# Altium project Example.PrjPcb
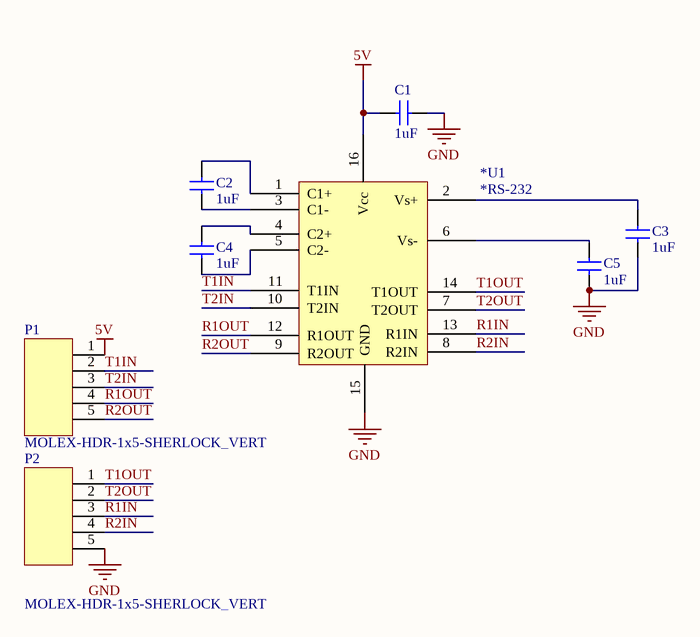
[diagram p0: Example.SchDoc]
1 sheet, 8 parts. Net scope: global (net labels, ports and power ports of the same name join across sheets).
Board file: Example.PcbDoc

## Sheet Example.SchDoc
size A

### Parts
*U1  *RS-232  [RS-232]
C1  value 1uF  [CAPC0603]  (hidden comment: Cap)
C2  value 1uF  [CAPC0603]  (hidden comment: Cap)
C3  value 1uF  [CAPC0603]  (hidden comment: Cap)
C4  value 1uF  [CAPC0603]  (hidden comment: Cap)
C5  value 1uF  [CAPC0603]  (hidden comment: Cap)
P1  MOLEX-HDR-1x5-SHERLOCK_VERT  [MOLEX-HDR-1X5-SHERLOCK-VERT]
P2  MOLEX-HDR-1x5-SHERLOCK_VERT  [MOLEX-HDR-1X5-SHERLOCK-VERT]

### Nets
5V: *U1.16(Vcc) C1.1(A) P1.1
GND: *U1.15(GND) C1.2(B) C3.2(B) C5.2(B) P2.5
R1IN: *U1.13(R1IN) P2.3
R1OUT: *U1.12(R1OUT) P1.4
R2IN: *U1.8(R2IN) P2.4
R2OUT: *U1.9(R2OUT) P1.5
T1IN: *U1.11(T1IN) P1.2
T1OUT: *U1.14(T1OUT) P2.1
T2IN: *U1.10(T2IN) P1.3
T2OUT: *U1.7(T2OUT) P2.2
Net*U1_1: *U1.1(C1+) C2.1(A)
Net*U1_2: *U1.2(Vs+) C3.1(A)
Net*U1_3: *U1.3(C1-) C2.2(B)
Net*U1_4: *U1.4(C2+) C4.1(A)
Net*U1_5: *U1.5(C2-) C4.2(B)
Net*U1_6: *U1.6(Vs-) C5.1(A)

### Library data of the parts
*U1 = RS-232: IC DVR/RCVR RS232 DUAL 16SOIC; Manufacturer 1: *Texas Instruments; Supplier 1: *Digi-Key; Supplier Part Number 1: *296-25009-1-ND; Manufacturer Part Number 1: *RS-232; ComponentLink1URL: *http://www.ti.com/lit/ds/symlink/trs232.pdf; ComponentLink1URL: *; ComponentLinkURL: *; ComponentLink1URL: asdfsdaf; ComponentLink1Description: Datasheet; ComponentLink1URL: http://www.ti.com/lit/ds/symlink/trs232.pdf; ComponentLink2Description: Website; ComponentLink2URL: https://www.digikey.com/product-detail/en/texas-instruments/TRS232DR/296-25009-1-ND/2136546
P1 P2 = MOLEX-HDR-1x5-SHERLOCK_VERT: Header, Molex, 2mm Pitch Sherlock Header, Single Row, Vertical, 5 Circuits, Length 3.3mm, 0353620550; Manufacturer Part Number: *; Order Part Number: *
C1-C5 = Cap: Supplier 1: Digi-Key; Supplier Part Number 1: 1276-1000-1-ND